# Altium project Thesis_PCB.PrjPcb
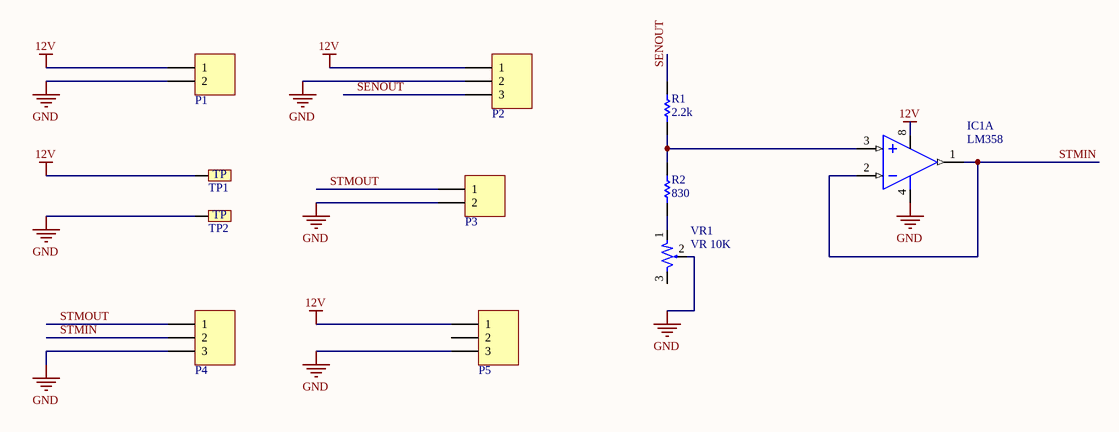
[diagram p0: SchmaticX.SchDoc]
1 sheet, 11 parts. Net scope: global (net labels, ports and power ports of the same name join across sheets).
Board file: PCB2.PcbDoc

## Sheet SchmaticX.SchDoc
size A4

### Parts
IC1  LM358  [DIP8]  (part A of 2)
P1  Domino 2  [DOMINO 2- 5mm]  (value not drawn)
P2  Header 3  [JP3]  (value not drawn)
P3  Domino 2  [DOMINO 2- 5mm]  (value not drawn)
P4  Header 3  [JP3]  (value not drawn)
P5  Domino 3  [DOMINO 3-5mm]  (value not drawn)
R1  value 2.2k  [RES-SM-0805]  (hidden comment: RESISTOR SMD)
R2  value 830  [RES-SM-0805]  (hidden comment: RESISTOR SMD)
TP1  Test Point  [TP]  (value not drawn)
TP2  Test Point  [TP]  (value not drawn)
VR1  value VR 10K  [Varistor 1]  (hidden comment: 10K)

### Nets
12V: IC1.8(+V) P1.1 P2.1 P5.1 TP1.TP1
GND: IC1.4(-V) P1.2 P2.2 P3.2 P4.3 P5.3 TP2.TP1 VR1.2
SENOUT: P2.3 R1.2
STMIN: IC1.1(OUT) IC1.2(IN-) P4.2
STMOUT: P3.1 P4.1
NetIC1_3: IC1.3(IN+) R1.1 R2.2
NetR2_1: R2.1 VR1.1

Not connected (* = marked no-connect by the designer): P5 2; VR1 3

### Notes on the sheet
- (in symbol Test Point) TP

### Library data of the parts
IC1 = LM358: Low-Power Dual Operational Amplifier; Value: LM358
P1 P3 = Domino 2: Domino, 2-Pin; LatestRevisionDate: 17-Jul-2002; LatestRevisionNote: Re-released for DXP Platform.; Publisher: Altium Limited
P2 P4 = Header 3: Header, 3-Pin; LatestRevisionDate: 17-Jul-2002; LatestRevisionNote: Re-released for DXP Platform.; Publisher: Altium Limited
P5 = Domino 3: Domino 3-Pin; LatestRevisionDate: 17-Jul-2002; LatestRevisionNote: Re-released for DXP Platform.; Publisher: Altium Limited
R1 R2 = RESISTOR SMD: Resistor
VR1 = Var Resistor